# Altium schematic sheet DPPXHK_USB_SD_DEBUG.SCHDOC
size A4
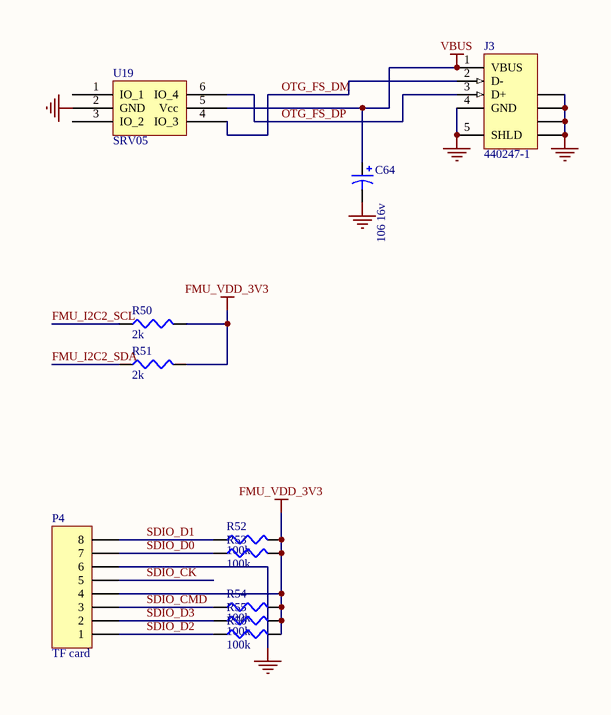
[diagram p0: DPPXHK_USB_SD_DEBUG.SCHDOC]

## Parts
C64  106 16v  [LC0402]
J3  440247-1  [MCRO_USB]
P4  TF card  [TF-2]
R50  2k  [0402R]
R51  2k  [0402R]
R52  100k  [0402R]
R53  100k  [0402R]
R54  100k  [0402R]
R55  100k  [0402R]
R56  100k  [0402R]
U19  SRV05  [SOT23-6]

## Nets
FMU_VDD_3V3: P4.4 R50.2 R51.2 R52.2 R53.2 R54.2 R55.2 R56.2
GND: C64.2 J3.4(GND) J3.5(SHLD) J3.6(SHLD) J3.7(SHLD) J3.8(SHLD) J3.9(SHLD) P4.6 U19.2(GND)
VBUS: C64.1 J3.1(VBUS) U19.5(Vcc)
FMU_I2C2_SCL: R50.1
FMU_I2C2_SDA: R51.1
OTG_FS_DM: J3.2(D-) U19.4(IO_3)
OTG_FS_DP: J3.3(D+) U19.6(IO_4)
SDIO_CK: P4.5
SDIO_CMD: P4.3 R54.1
SDIO_D0: P4.7 R53.1
SDIO_D1: P4.8 R52.1
SDIO_D2: P4.1 R56.1
SDIO_D3: P4.2 R55.1

Not connected (* = marked no-connect by the designer): U19 1(IO_1) 3(IO_2)

## Library data of the parts
C64 = Cap Pol3: Polarized Capacitor (Surface Mount); Published: 8-Jun-2000; LatestRevisionDate: 17-Jul-2002; LatestRevisionNote: Re-released for DXP Platform.; PackageReference: C0805; Publisher: Altium Limited
J3 = 440247-1: USB 2.0, Right Angle, SMT, B Type, Receptacle, 5 Position, Black; ContactMaterial: Copper Alloy; ContactPlating: Gold (30); PCB_Layout: Complies with manufacturer's recommendation.; DrillSize: Corresponds to nominal value.; PanelGround: Without; Published: 15-Jul-2004; DatasheetDocument: 27-Jun-2003; PackageDocument: 27-Jun-2003; PackageReference: 440247; Publisher: Altium Limited; ComponentLink1Description: Manufacturer Link; ComponentLink1URL: http://www.tycoelectronics.com/; HousingMaterial: Thermoplastic
P4 = Header 8: Header, 8-Pin; LatestRevisionDate: 17-Jul-2002; LatestRevisionNote: Re-released for DXP Platform.; Publisher: Altium Limited
R50-R56 = Res3: Resistor; Published: 8-Jun-2000; LatestRevisionDate: 4-Mar-2005; LatestRevisionNote: PCB Footprint replaced.; Publisher: Altium Limited